# EAGLE design lampicka (EAGLE 9.5.1)
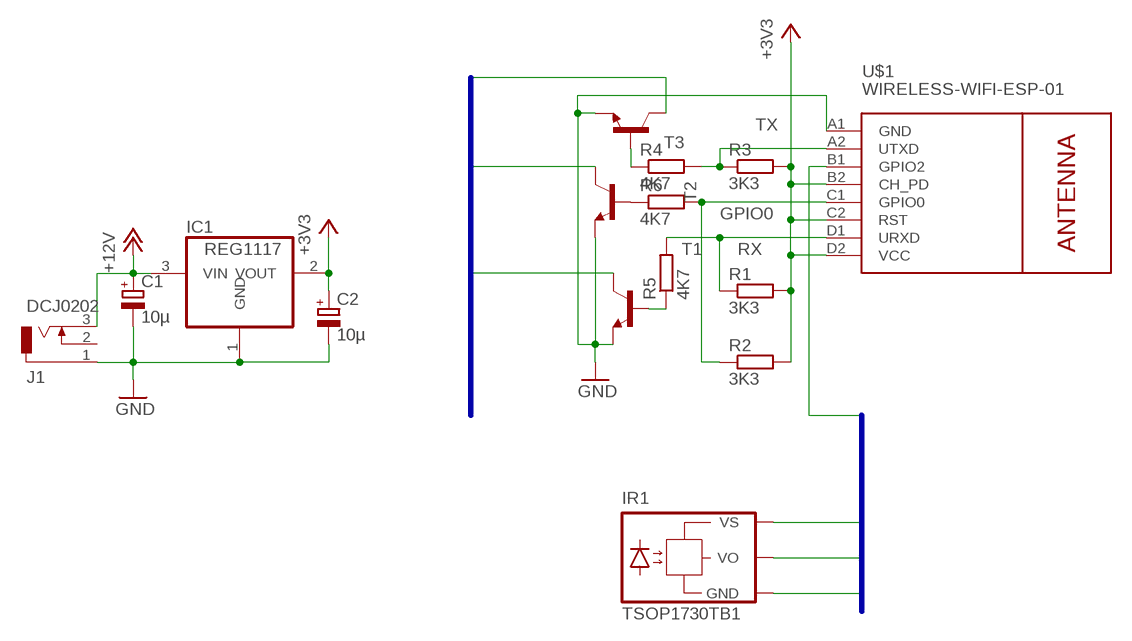
[diagram p0: schematic, sheet 1]

## Parts
C1  10µ  CPOL-EUD/7343-31R  [D/7343-31R]
C2  10µ  CPOL-EUD/7343-31R  [D/7343-31R]
IC1  REG1117  [SOT223]
IR1  TSOP1730TB1  [TSOP17_TB1]
J1  DCJ0202  [DCJ0202]
R1  3K3  R-EU_M1206  [M1206]
R2  3K3  R-EU_M1206  [M1206]
R3  3K3  R-EU_M1206  [M1206]
R4  4K7  R-EU_M1206  [M1206]
R5  4K7  R-EU_M1206  [M1206]
R6  4K7  R-EU_M1206  [M1206]
T1  MMBT2222ALT1-NPN-SOT23-BEC  [SOT23-BEC]
T2  MMBT2222ALT1-NPN-SOT23-BEC  [SOT23-BEC]
T3  MMBT2222ALT1-NPN-SOT23-BEC  [SOT23-BEC]
U$1  WIRELESS-WIFI-ESP-01  [WIRELESS-WIFI-ESP-01]

## Nets
+3V3: C2.+ IC1.2(VOUT) IR1.VS R1.2 R2.2 R3.2 U$1.B2(CH_PD) U$1.C2(RST) U$1.D2(VCC)
+12V: C1.+ IC1.3(VIN) J1.3
BLUE: T1.C
GND: C1.- C2.- IC1.1(GND) IR1.GND J1.1 T1.E T2.E T3.E U$1.A1(GND)
GPIO0: R2.1 R6.2 U$1.C1(GPIO0)
GREEN: T3.C
IR: IR1.VO U$1.B1(GPIO2)
N$1: R6.1 T3.B
N$2: R5.1 T1.B
N$3: R4.1 T2.B
RED: T2.C
RX: R1.1 R5.2 U$1.D1(URXD)
TX: R3.1 R4.2 U$1.A2(UTXD)
Unconnected: J1.2

## Buses
RGB:+12V,BLUE,GREEN,RED
IR:+3V3,GND,IR

## Library data of the parts
C1 C2 = rcl:CPOL-EU: POLARIZED CAPACITOR, European symbol; SPICEPREFIX: C
IC1 = burr-brown:REG1117: 800mA and 1A Low Dropout (LDO) Positive Regulator 1.8V, 2.5V, 2.85V, 3.3V, 5V, and Adj; MPN: REG1117; OC_FARNELL: 1097566; OC_NEWARK: 14P6981; SPICEPREFIX: J
IR1 = telefunken:TSOP17*TB1: TSOP17..TB1 IR Receiver Modules for Remote Control Systems Source: http://www.vishay.com/docs/82042/82042.pdf; OC_FARNELL: unknown; OC_NEWARK: unknown
J1 = con-jack:DCJ0202: DC POWER JACK Source: DCJ0202.pdf; OC_FARNELL: unknown; OC_NEWARK: unknown
R1-R6 = rcl:R-EU_: RESISTOR, European symbol; SPICEPREFIX: R
T1-T3 = transistor:*-NPN-: NPN Transistror BF959 corrected 2008.03.06
U$1 = diy-modules:WIRELESS-WIFI-ESP-01: Wireless Wi-Fi ESP-01 Module based on ESP8266 chip Click here to find device on ebay.com <http://www.ebay.com/sch/esp8266+esp+01+transceiver>

## Board
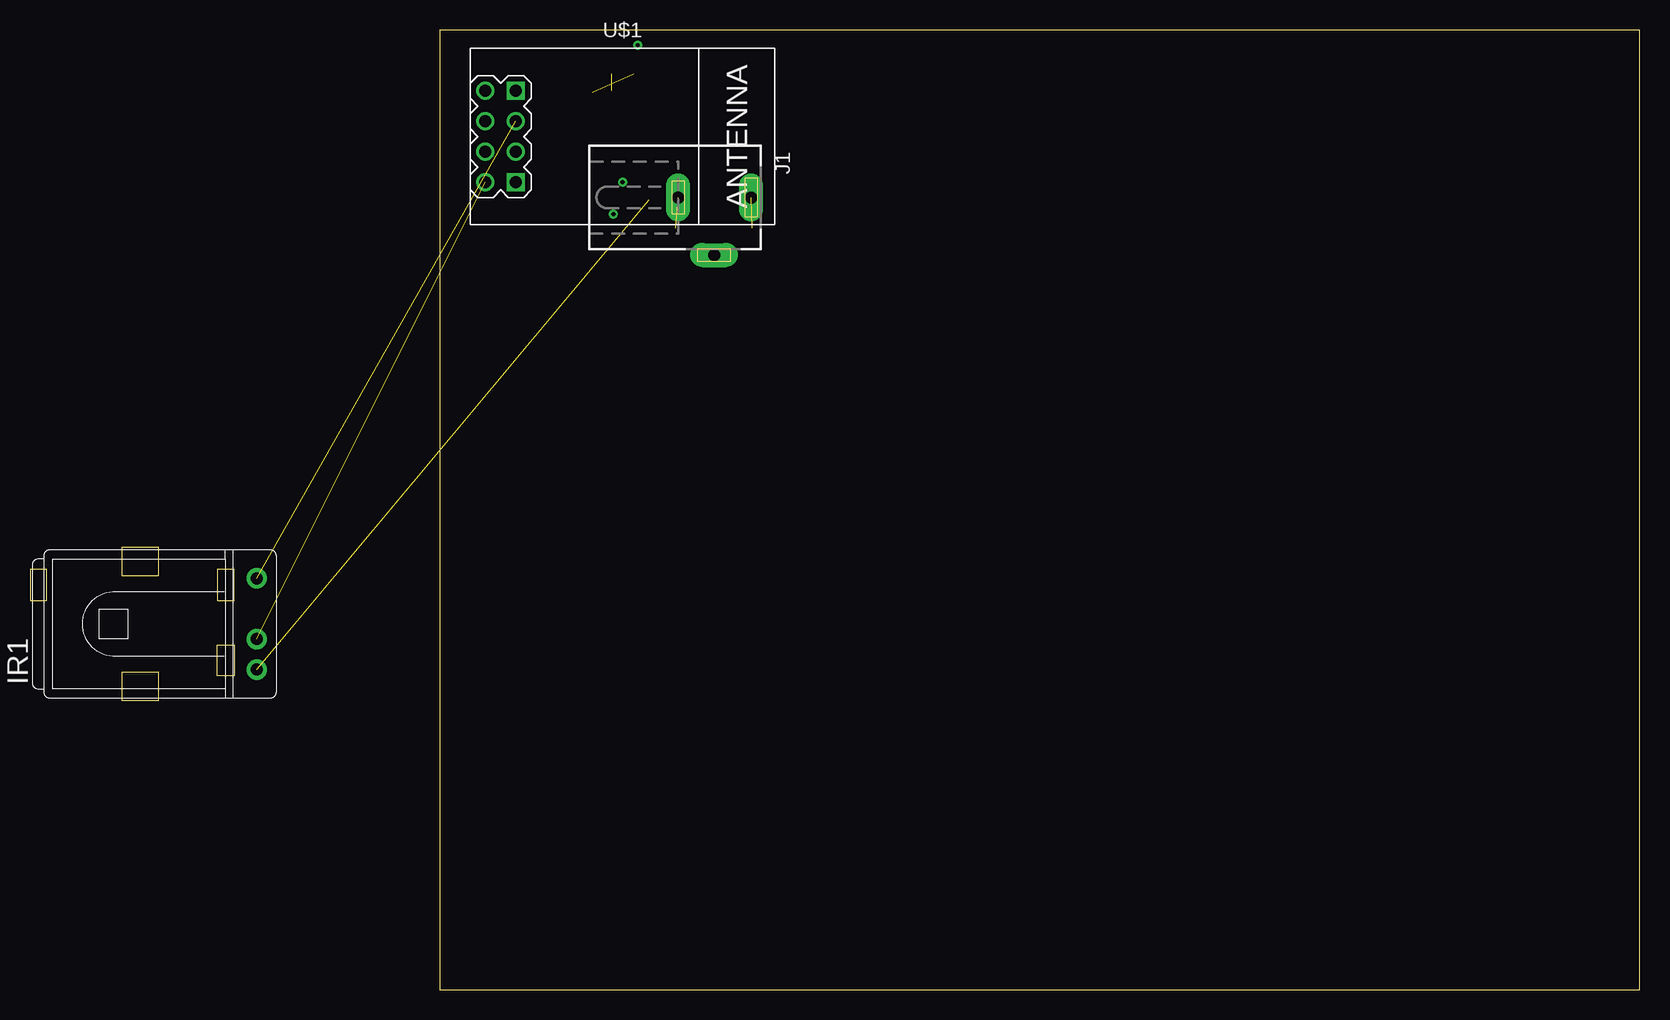
[diagram p1: board, top side]
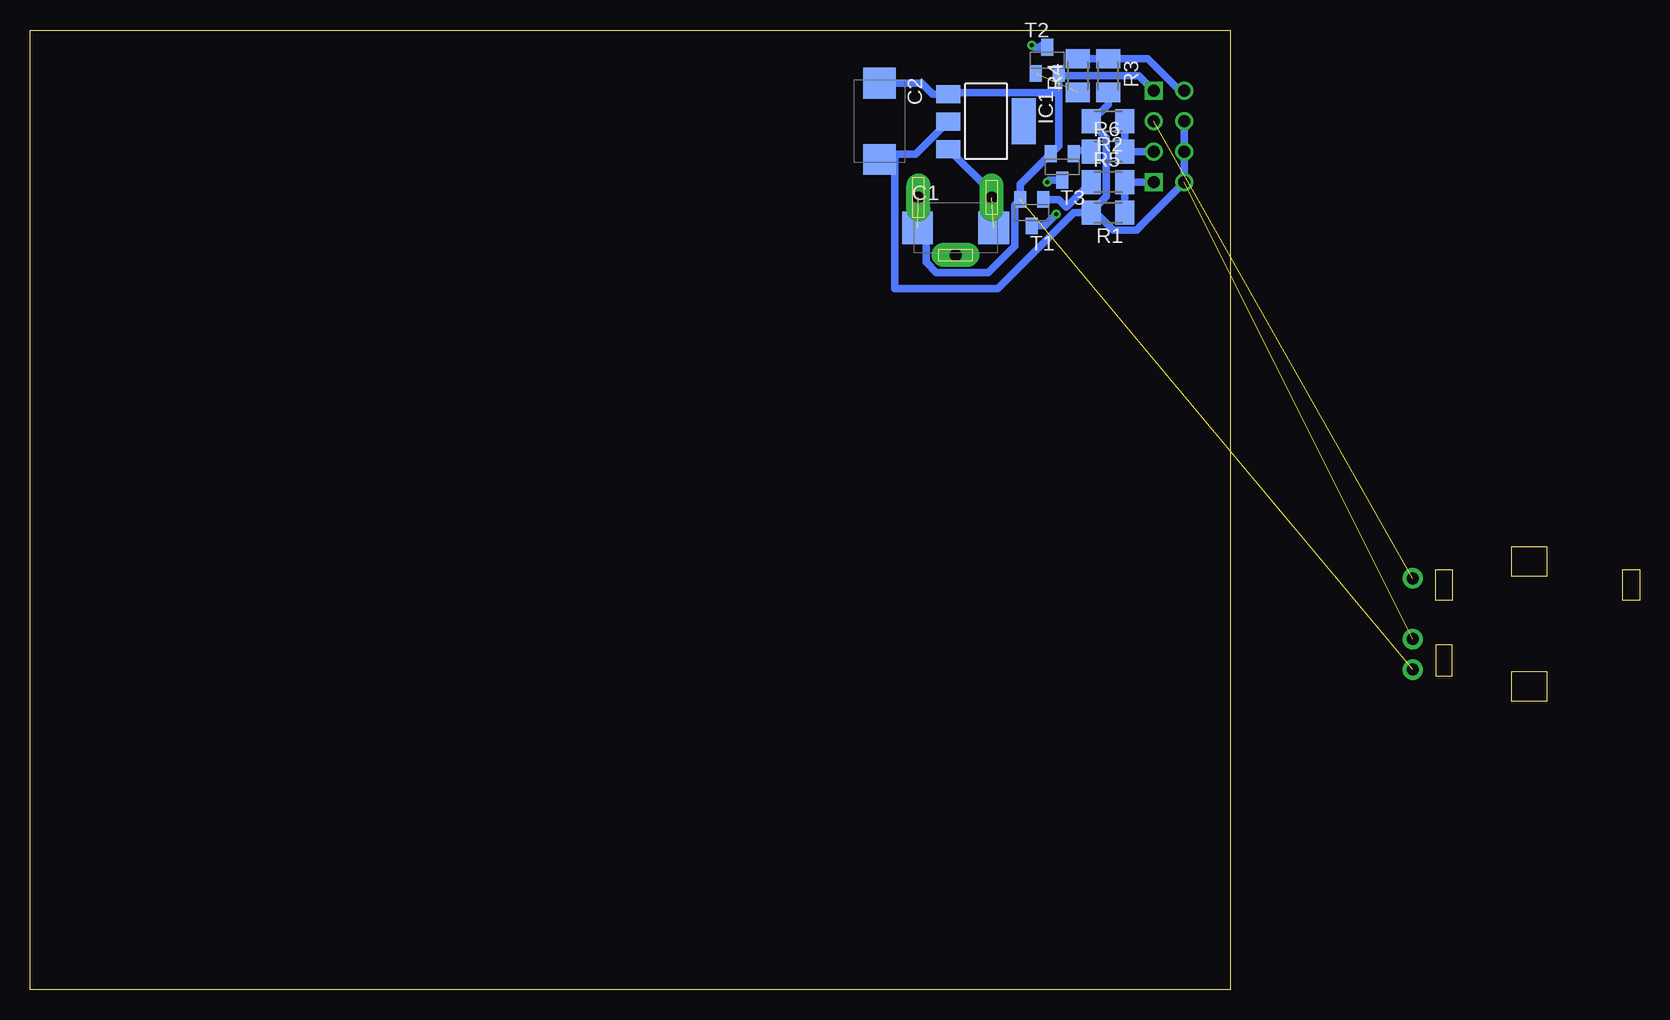
[diagram p2: board, bottom side, seen from below]

Size 100 x 80 mm. Coordinates in mm from the lower left corner, seen from the top.
Outline: 0,0 100,0 100,80 0,80 0,0
Copper layers (1*16): Top 0.035mm / dielectric 1.5mm / Bottom 0.035mm
Design rules "default": minimum track width 6mil, minimum drill 0.35mm, track to track 6mil, track to pad 6mil, pad to pad 6mil, via to via 6mil, smd to smd 6mil, copper to edge 40mil, drill to drill 6mil, minimum pad ring 10mil, minimum via ring 8mil, stop-mask expansion 4mil, vias tented up to drill 0mil, thermal gap 10mil

### Footprints (pad centres in the part's own frame; a part is rotated, then mirrored left to right if it is on the bottom)
D/7343-31R = smd 2.55 x 2.7: + 3.175,0; - -3.175,0
SOT223 = smd 1.499 x 2.007: 1 -2.261,-3.15; 2 0.025,-3.15; 3 2.311,-3.15 | smd 3.81 x 2.007: 4 0,3.15
TSOP17_TB1 = drill 1 pad 1.676: GND 0,-3.81; VO 0,3.81; VS 0,-1.27
DCJ0202 = drill 1 pad 2 long: 1 0,3.1; 2 4.8,0; 3 0,-3
M1206 = smd 1.6 x 2: 1 -1.4,0; 2 1.4,0
SOT23-BEC = smd 1 x 1.4: B -0.95,-1.1; C 0,1.1; E 0.95,-1.1
WIRELESS-WIFI-ESP-01 = drill 1 square: A1 -8.89,3.81; D1 -8.89,-3.81 | drill 1: A2 -11.43,3.81; B1 -8.89,1.27; B2 -11.43,1.27; C1 -8.89,-1.27; C2 -11.43,-1.27; D2 -11.43,-3.81

### Placement (x,y rotation side)
C1  22.86,63.5 0 bottom
C2  29.21,72.39 270 bottom
IC1  20.32,72.39 270 bottom
IR1  -15.24,30.48 0 top  (outside the outline)
J1  22.86,66.04 270 top
R1  10.16,64.77 180 bottom
R2  10.16,72.39 180 bottom
R3  10.16,76.2 270 bottom
R4  12.7,76.2 90 bottom
R5  10.16,67.31 0 bottom
R6  10.16,69.85 0 bottom
T1  16.51,64.77 180 bottom
T2  15.24,77.47 0 bottom
T3  13.97,68.58 180 bottom
U$1  15.24,71.12 0 top

### Tracks (layer width: path | path; a pad name or v marks a point on that pad's centre or on a via)
+3V3  (1 unrouted)
  Bottom 0.61: U$1.B2 U$1.C2 U$1.D2 7.5,63.62 7.5,63.58 7.77,63.31 9.75,63.31 11.21,64.77 R1.2 | R3.2 10.16,73.79 R2.2 11.56,72.3 10.3,71.04 10.3,66.12 11.56,64.86 R1.2 | IC1.2 26.2,69.63 26.67,69.63 27.94,69.63 | R1.2 13.02,64.77 19.37,58.42 27.94,58.42 27.94,69.63 | C2.+ 28.79,69.63 27.94,69.63
+12V  (1 unrouted)
  Bottom 0.61: IC1.3 19.86,66.47 J1.3
BLUE  (via drill 0.35)
  Bottom 0.61: v14.48,64.64 15.45,63.67 T1.C
GND  (3 unrouted)
  Bottom 0.61: U$1.A1 7.62,76.2 14.46,76.2 T2.E 14.29,74.75 23.37,74.75 IC1.1 24.79,74.65 25.71,75.56 C2.- | 14.29,74.93 14.29,70.31 T3.E 17.46,67.14 T1.E 17.95,65.38 17.95,61.96 20.13,59.78 24.46,59.78 25.32,60.64 25.32,62.78 C1.-
GPIO0
  Bottom 0.61: U$1.C1 R6.2 R2.1
GREEN  (via drill 0.35)
  Bottom 0.61: T3.C 15.12,67.48 v15.24,67.31
IR  (1 unrouted)
N$1
  Bottom 0.61: R6.1 11.88,70.17 T3.B
N$2
  Bottom 0.61: T1.B 14.29,65.87 13.64,65.22 R5.1
N$3  (1 unrouted)
RED  (via drill 0.35)
  Bottom 0.61: 15.68,78.74 15.54,78.57 T2.C 16.34,78.57 v16.51,78.74
RX
  Bottom 0.61: R1.1 R5.2 U$1.D1
TX
  Bottom 0.61: U$1.A2 4.2,74.93 6.86,77.6 R3.1 R4.2